# Altium project MSP430贴片转直插板.PrjPCB
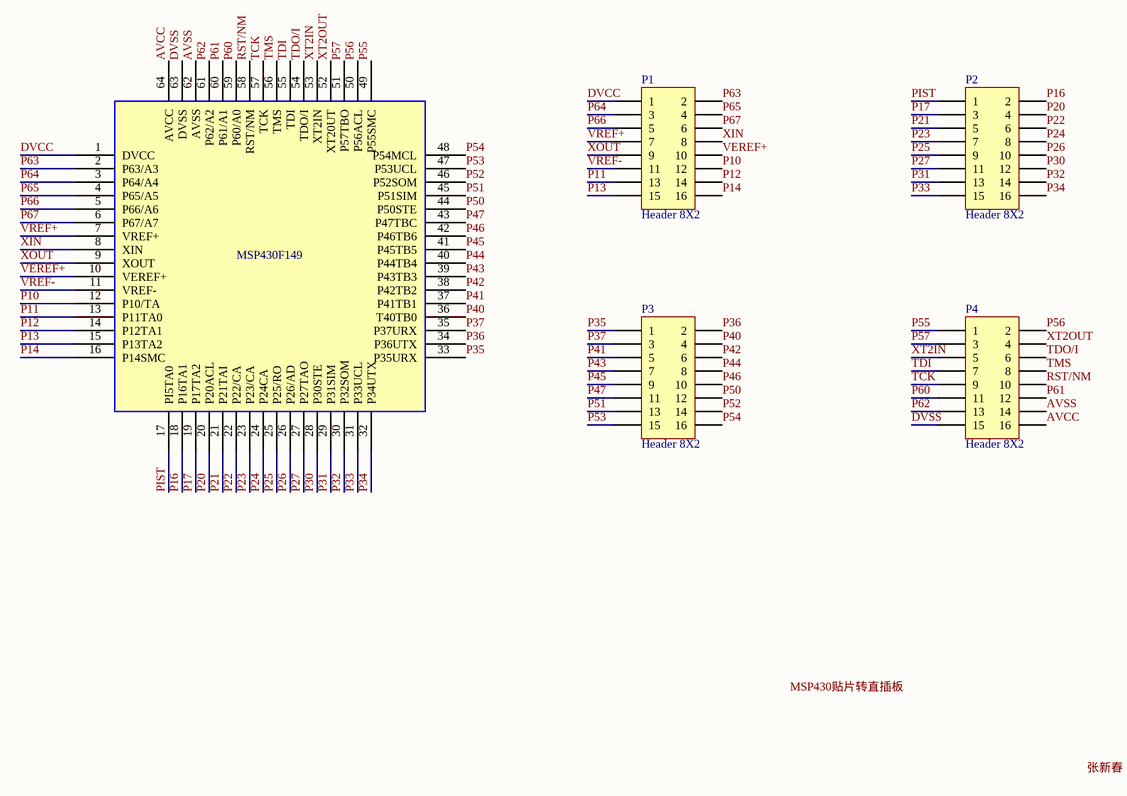
[diagram p0: MSP430贴片转直插板.SchDoc]
1 sheet, 5 parts. Net scope: global (net labels, ports and power ports of the same name join across sheets).
Board file: MSP430贴片转直插板.PcbDoc

## Sheet MSP430贴片转直插板.SchDoc
size A4

### Parts
P1  Header 8X2  [HDR2X8]
P2  Header 8X2  [HDR2X8]
P3  Header 8X2  [HDR2X8]
P4  Header 8X2  [HDR2X8]
  MSP430F149  [MSP41X]

### Nets
AVCC: P4.16 .64(AVCC)
AVSS: P4.14 .62(AVSS)
DVCC: P1.1 .1(DVCC)
DVSS: P4.15 .63(DVSS)
P10: P1.12 .12(P10/TA)
P11: P1.13 .13(P11TA0)
P12: P1.14 .14(P12TA1)
P13: P1.15 .15(P13TA2)
P14: P1.16 .16(P14SMC)
P16: P2.2 .18(P16TA1)
P17: P2.3 .19(P17TA2)
P20: P2.4 .20(P20ACL)
P21: P2.5 .21(P21TAI)
P22: P2.6 .22(P22/CA)
P23: P2.7 .23(P23/CA)
P24: P2.8 .24(P24CA)
P25: P2.9 .25(P25/RO)
P26: P2.10 .26(P26/AD)
P27: P2.11 .27(P27TAO)
P30: P2.12 .28(P30STE)
P31: P2.13 .29(P31SIM)
P32: P2.14 .30(P32SOM)
P33: P2.15 .31(P33UCL)
P34: P2.16 .32(P34UTX)
P35: P3.1 .33(P35URX)
P36: P3.2 .34(P36UTX)
P37: P3.3 .35(P37URX)
P40: P3.4 .36(T40TB0)
P41: P3.5 .37(P41TB1)
P42: P3.6 .38(P42TB2)
P43: P3.7 .39(P43TB3)
P44: P3.8 .40(P44TB4)
P45: P3.9 .41(P45TB5)
P46: P3.10 .42(P46TB6)
P47: P3.11 .43(P47TBC)
P50: P3.12 .44(P50STE)
P51: P3.13 .45(P51SIM)
P52: P3.14 .46(P52SOM)
P53: P3.15 .47(P53UCL)
P54: P3.16 .48(P54MCL)
P55: P4.1 .49(P55SMC)
P56: P4.2 .50(P56ACL)
P57: P4.3 .51(P57TBO)
P60: P4.11 .59(P60/A0)
P61: P4.12 .60(P61/A1)
P62: P4.13 .61(P62/A2)
P63: P1.2 .2(P63/A3)
P64: P1.3 .3(P64/A4)
P65: P1.4 .4(P65/A5)
P66: P1.5 .5(P66/A6)
P67: P1.6 .6(P67/A7)
PIST: P2.1 .17(PI5TA0)
RST/NM: P4.10 .58(RST/NM)
TCK: P4.9 .57(TCK)
TDI: P4.7 .55(TDI)
TDO/I: P4.6 .54(TDO/I)
TMS: P4.8 .56(TMS)
VEREF+: P1.10 .10(VEREF+)
VREF+: P1.7 .7(VREF+)
VREF-: P1.11 .11(VREF-)
XIN: P1.8 .8(XIN)
XOUT: P1.9 .9(XOUT)
XT2IN: P4.5 .53(XT2IN)
XT2OUT: P4.4 .52(XT20UT)

### Notes on the sheet
- Labels drawn without touching a wire or pin: MSP430贴片转直插板, 张新春

### Library data of the parts
P1-P4 = Header 8X2: Header, 8-Pin, Dual row; LatestRevisionDate: 17-Jul-2002; LatestRevisionNote: Re-released for DXP Platform.; Publisher: Altium Limited
 = MSP430F133